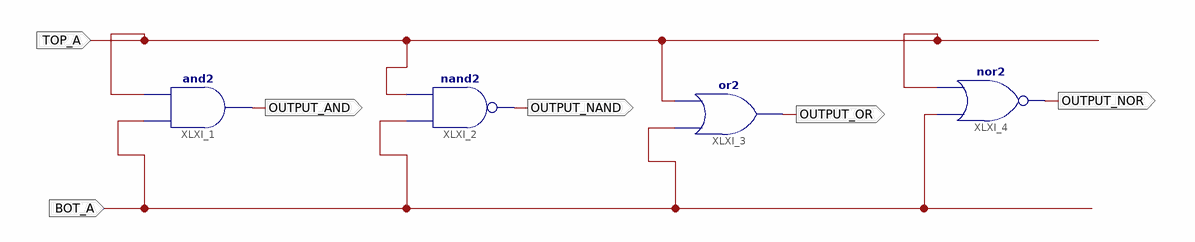
[diagram p0: schematic sheet 1]
// Xilinx ISE schematic LAB_1.sch (spartan3e) as structural Verilog: 4 symbols, 6 ports
module LAB_1 (
  input  TOP_A,
  input  BOT_A,
  output OUTPUT_AND,
  output OUTPUT_NAND,
  output OUTPUT_OR,
  output OUTPUT_NOR
);

  and XLXI_1 (OUTPUT_AND, BOT_A, TOP_A);
  nand XLXI_2 (OUTPUT_NAND, BOT_A, TOP_A);
  or XLXI_3 (OUTPUT_OR, BOT_A, TOP_A);
  nor XLXI_4 (OUTPUT_NOR, BOT_A, TOP_A);
endmodule
